# Altium schematic sheet USB_C2.SchDoc
size A4; SheetNumber: 7; SheetTotal: 8
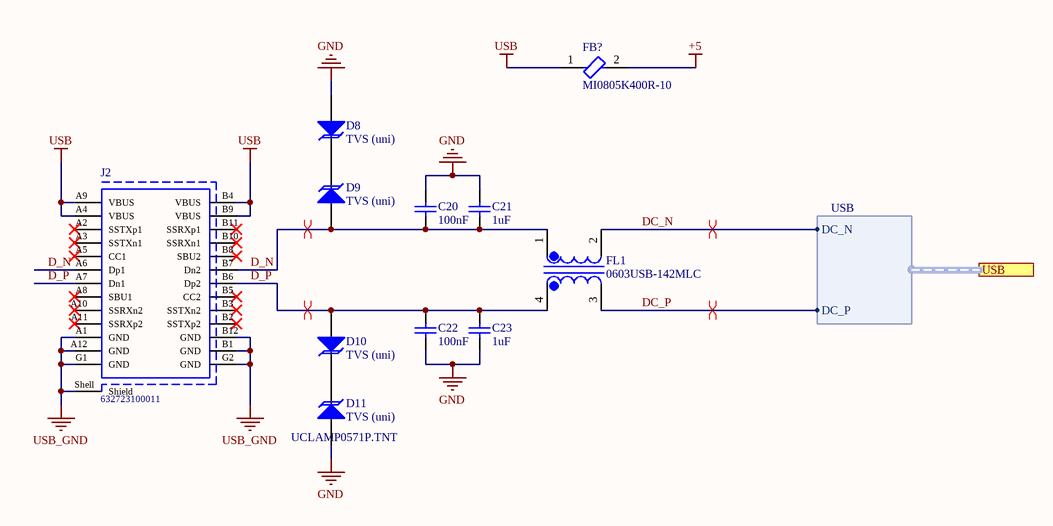
[diagram p0: USB_C2.SchDoc]

## Parts
C20  100nF
C21  1uF
C22  100nF
C23  1uF
D8  TVS (uni)
D9  TVS (uni)
D10  TVS (uni)
D11  TVS (uni)
FB?  MI0805K400R-10  [FP-MI0805-MFG]
FL1  0603USB-142MLC  [FIL_0603USB-142MLC]
J2  632723100011  [632723100011]

## Ports
USB (harness USB)

## Harnesses
USB: DC_N, DC_P

## Nets
+5: FB?.2
GND: C20.2 C21.2 C22.1 C23.1 D8.1(A) D11.1(A)
USB: FB?.1 J2.A4(VBUS) J2.A9(VBUS) J2.B4(VBUS) J2.B9(VBUS)
USB_GND: J2.A1(GND) J2.A12(GND) J2.B1(GND) J2.B12(GND) J2.G1(GND) J2.G2(GND) J2.Shell(Shield)
D_N: C20.1 C21.1 D9.1(A) FL1.1 J2.A6(Dp1) J2.B7(Dn2)
D_P: C22.2 C23.2 D10.1(A) FL1.4 J2.A7(Dn1) J2.B6(Dp2)
DC_N: FL1.2 ; port USB.DC_N
DC_P: FL1.3 ; port USB.DC_P
NetD8_2: D8.2(K) D9.2(K)
NetD10_2: D10.2(K) D11.2(K)

Not connected (* = marked no-connect by the designer): J2 A2(SSTXp1)* A3(SSTXn1)* A5(CC1)* A8(SBU1)* A10(SSRXn2)* A11(SSRXp2)* B2(SSTXp2)* B3(SSTXn2)* B5(CC2)* B8(SBU2)* B10(SSRXn1)* B11(SSRXp1)*

## Layout directives
differential pair: D_N, D_P, DC_N, DC_P

## Notes on the sheet
- (near D11) UCLAMP0571P.TNT

## Library data of the parts
C20 C22 = 100nF: Capacitor; Published: 8-Jun-2000; LatestRevisionDate: 17-Jul-2002; LatestRevisionNote: Re-released for DXP Platform.; PackageReference: RAD-0.3; Publisher: Altium Limited; PackageDescription: Radial Cap, Thru-Hole; 2 Leads; 0.3 in Pin Spacing
C21 C23 = 1uF: Capacitor; Published: 8-Jun-2000; LatestRevisionDate: 17-Jul-2002; LatestRevisionNote: Re-released for DXP Platform.; PackageReference: RAD-0.3; Publisher: Altium Limited; PackageDescription: Radial Cap, Thru-Hole; 2 Leads; 0.3 in Pin Spacing
D8-D11 = TVS (uni): TVS Diode; Published: 8-Jun-2000; LatestRevisionDate: 17-Jul-2002; LatestRevisionNote: Re-released for DXP Platform.; PackageReference: DIODE-0.7; Publisher: Altium Limited; PackageDescription: Diode, Thru-Hole; 2 Leads; 0.7 in Pin Spacing
FB? = CMP-2000-06702-2: FERRITE BEAD 40 OHM 0805 1LN; Impedance: 40R; Max Current Rating: 1.5A; Tolerance: 25%; Test Frequency: 100MHz; DC Resistance (DCR): 50mR; Number of Lines: 1; Min Operating Temperature: -40°C; Case/Package: 0805; Depth: 1.45mm; Current Rating: 1.5A; Width: 0.049inch; Core Material: Ferrite; Termination: SMD/SMT; Case Code (Imperial): 0805; Packaging: Tape and Reel; Weight: 0.00392oz; Lead Free: Lead Free; Length: 2mm; Max Operating Temperature: 125°C; Mount: Surface Mount; Case Code (Metric): 2012; Frequency: 100MHz; Height: 0.043inch; Package Quantity: 1; Material: Ferrite; Contact Plating: Tin; Max DC Current: 1.5A
FL1 = 0603USB-142MLC: Common mode filter, USB/IEEE 1394, SMT, RoHS mon mode filter, USB/IEEE 1394, SMT, RoHS; Package: None; Price: None; Value: *; MP: 0603USB-142MLC; Availability: Unavailable
J2 = CMP-1502-03213-1: USB 3.1 Type C Receptacle WR-COM, Horizontal, SMT / THT; Manufacturer: Wurth Elektronik; Working Voltage: 20VDC; Rated Current: 5A; Contact Resistance: 30mOhm; Operating Temperature: -40to105degC; Publisher: WurthElektronik; Gender: Receptacle; Part Number: 632723100011; Mounting Technology: SMT/THT; Datasheet URL: https://katalog.we-online.de/em/datasheet/632723x00011%282%29.pdf; Connector Type: USB3.1TypeC; Manufacturer URL: http://www.we-online.de; Orientation: Horizontal; Package Reference: 632723100011; Packaging: TapeandReel